# Altium schematic sheet USB Comms.SchDoc: RB25DET - USB Comms
size A4; Address1: Drawn By:; Address2: Dan Visser; DocumentNumber: A; Revision: 0.1; SheetNumber: 3; SheetTotal: 12
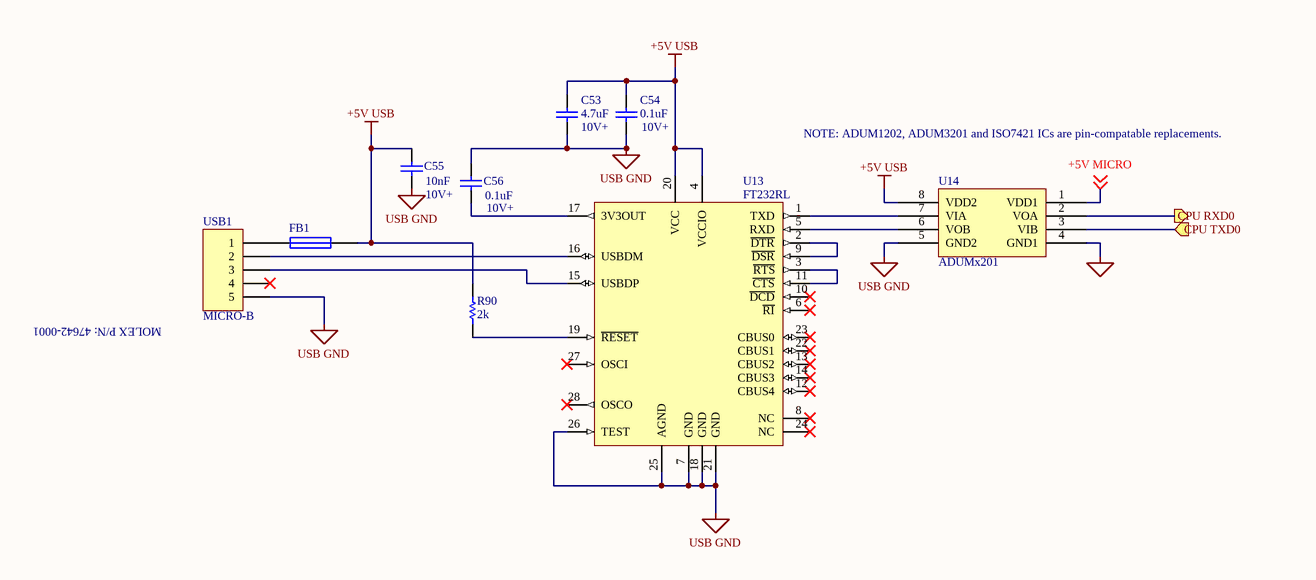
[diagram p0: USB Comms.SchDoc]

## Parts
C53  value 4.7uF  [RAD-0.3]
C54  value 0.1uF  [RAD-0.3]
C55  value 10nF  [RAD-0.3]
C56  value 0.1uF  [RAD-0.3]
FB1  (no value)  [PIN-W2/E2.8]
R90  value 2k  [AXIAL-0.3]
U13  FT232RL  [SSOP-28_M]
U14  ADUMx201
USB1  MICRO-B  [HDR1X5]

## Ports
CPU RXD0 (out), CPU TXD0 (in)

## Nets
+5V USB: C53.2 C54.2 C55.2 FB1.2 R90.2 U13.4(VCCIO) U13.20(VCC) U14.8(VDD2)
USB GND: C53.1 C54.1 C55.1 C56.2 U13.7(GND) U13.18(GND) U13.21(GND) U13.25(AGND) U13.26(TEST) U14.5(GND2) USB1.5
+5V MICRO: U14.1(VDD1) ; off-sheet +5V MICRO
CPU RXD0: U14.2(VOA) ; port CPU RXD0
CPU TXD0: U14.3(VIB) ; port CPU TXD0
NetC56_1: C56.1 U13.17(3V3OUT)
NetR90_1: R90.1 U13.19(~{RESET})
NetU13_1: U13.1(TXD) U14.7(VIA)
NetU13_2: U13.2(~{DTR}) U13.9(~{DSR})
NetU13_3: U13.3(~{RTS}) U13.11(~{CTS})
NetU13_5: U13.5(RXD) U14.6(VOB)
NetU13_15: U13.15(USBDP) USB1.3
NetU13_16: U13.16(USBDM) USB1.2

Not connected (* = marked no-connect by the designer): FB1 1; U13 6(~{RI})* 8(NC)* 10(~{DCD})* 12(CBUS4)* 13(CBUS2)* 14(CBUS3)* 22(CBUS1)* 23(CBUS0)* 24(NC)* 27(OSCI)* 28(OSCO)*; U14 4(GND1); USB1 1 4*

## Notes on the sheet
- 10V+
- (near C54) 10V+
- NOTE: ADUM1202, ADUM3201 and ISO7421 ICs are pin-compatable replacements.
- (near C56) 10V+
- (near USB1) MOLEX P/N: 47642-0001
- Title
- Size:
- Date:
- A4
- Number:
- Time:
- Revision:
- Sheet
- of

## Library data of the parts
C53-C56 = Cap: Capacitor; Published: 8-Jun-2000; LatestRevisionDate: 17-Jul-2002; LatestRevisionNote: Re-released for DXP Platform.; PackageReference: RAD-0.3; Publisher: Altium Limited; PackageDescription: Radial Cap, Thru-Hole; 2 Leads; 0.3 in Pin Spacing
FB1 = Fuse 1: Published: 8-Jun-2000; LatestRevisionDate: 17-Jul-2002; LatestRevisionNote: Re-released for DXP Platform.; PackageReference: PIN-W2/E2.8; Publisher: Altium Limited; PackageDescription: Thru-Hole; 2 Leads
R90 = Res1: Resistor; Published: 8-Jun-2000; LatestRevisionDate: 17-Jul-2002; LatestRevisionNote: Re-released for DXP Platform.; PackageReference: AXIAL-0.3; Publisher: Altium Limited; PackageDescription: Axial Device, Thru-Hole; 2 Leads; 0.3 in Pin Spacing
U13 = FT232RL-Tray: USB UART Asynchronous Serial Data Transfer Chip, SSOP-28, Tray; Published: 19-Aug-2010; DatasheetVersion: ver 2.07, Jul-2010; PackageVersion: 2010; PackageReference: SSOP-28; Publisher: Altium Limited; PackageDescription: 28-Pin Small Outline Package 0.65 mm Pitch; ComponentLink1Description: Manufacturer Link; ComponentLink1URL: http://www.ftdichip.com/Products/ICs/FT232R.htm; ComponentLink2Description: Datasheet; ComponentLink2URL: http://www.ftdichip.com/Support/Documents/DataSheets/ICs/DS_FT232R.pdf
U14 = ADUM3201
USB1 = Header 5: Header, 5-Pin; LatestRevisionDate: 17-Jul-2002; LatestRevisionNote: Re-released for DXP Platform.; Publisher: Altium Limited